# Altium schematic sheet Sheet1.SchDoc
size A4; SheetNumber: 1; SheetTotal: 1
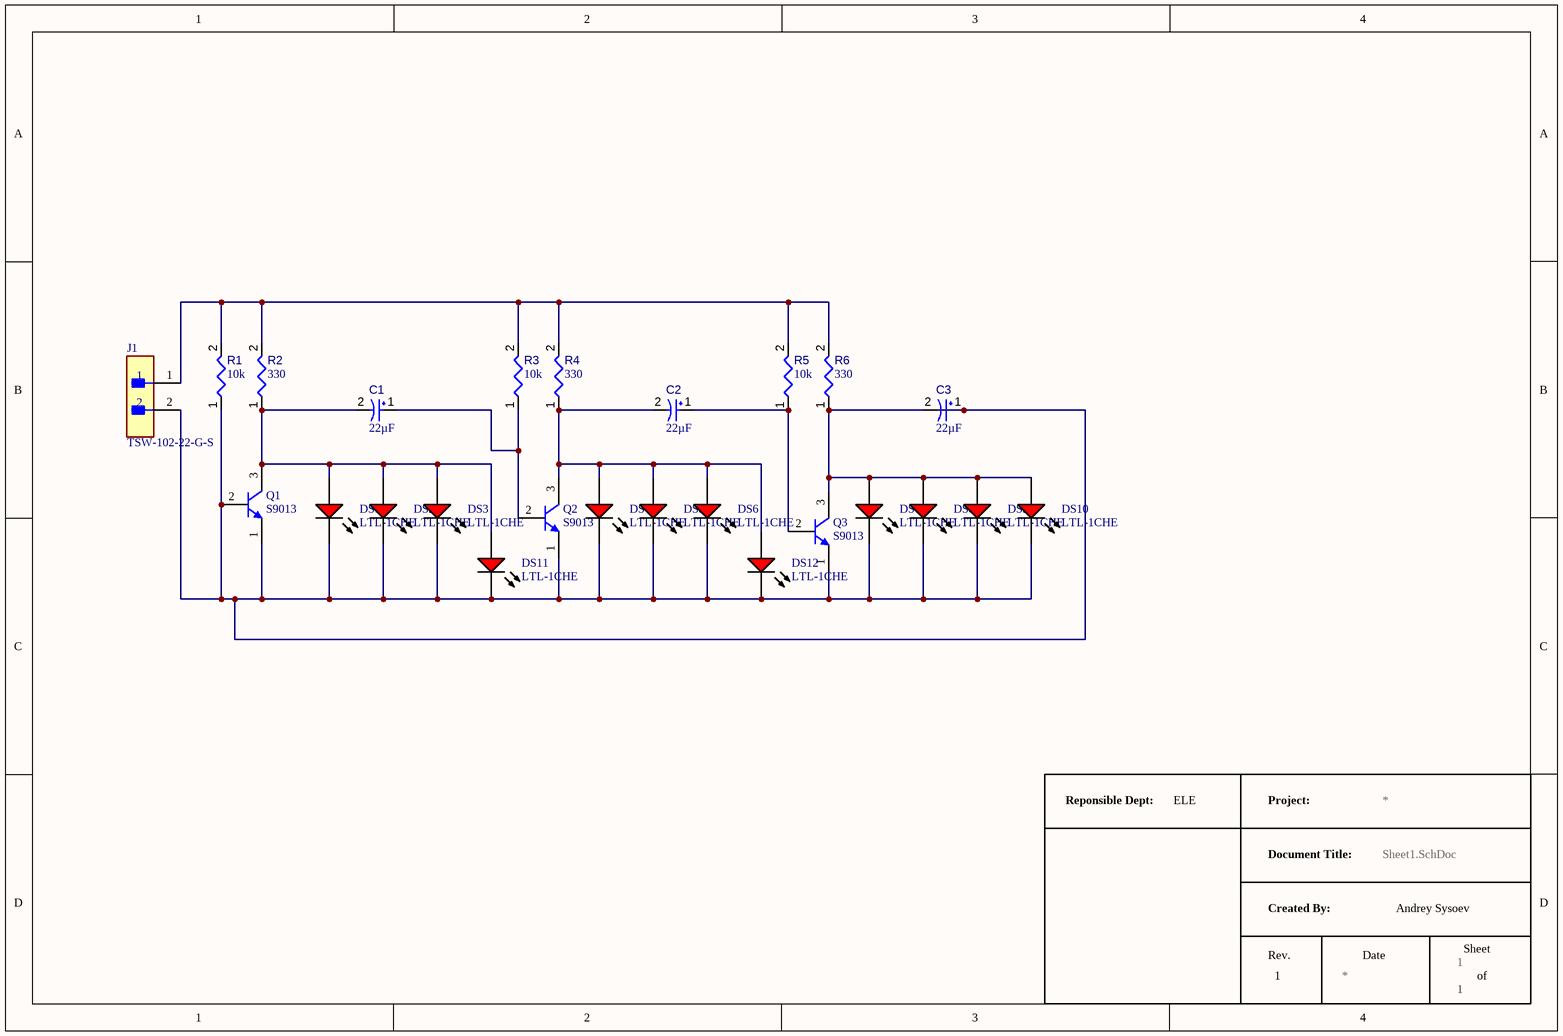
[diagram p0: Sheet1.SchDoc]

## Parts
*  HSHL title block  (value not drawn)  (graphical)
C1  value 22µF  [CAPPR55-250-1120X630X1220]  (hidden comment: ECA-2AM220)
C2  value 22µF  [CAPPR55-250-1120X630X1220]  (hidden comment: ECA-2AM220)
C3  value 22µF  [CAPPR55-250-1120X630X1220]  (hidden comment: ECA-2AM220)
DS1  LTL-1CHE  [INDPR60-254-520X380X650]
DS2  LTL-1CHE  [INDPR60-254-520X380X650]
DS3  LTL-1CHE  [INDPR60-254-520X380X650]
DS4  LTL-1CHE  [INDPR60-254-520X380X650]
DS5  LTL-1CHE  [INDPR60-254-520X380X650]
DS6  LTL-1CHE  [INDPR60-254-520X380X650]
DS7  LTL-1CHE  [INDPR60-254-520X380X650]
DS8  LTL-1CHE  [INDPR60-254-520X380X650]
DS9  LTL-1CHE  [INDPR60-254-520X380X650]
DS10  LTL-1CHE  [INDPR60-254-520X380X650]
DS11  LTL-1CHE  [INDPR60-254-520X380X650]
DS12  LTL-1CHE  [INDPR60-254-520X380X650]
J1  TSW-102-22-G-S  [FP-TSW-102-22-G-S-MFG]
Q1  S9013  [JSCJ-TO-92-3_V]
Q2  S9013  [JSCJ-TO-92-3_V]
Q3  S9013  [JSCJ-TO-92-3_V]
R1  value 10k  [RESA60-630X240]  (hidden comment: MFR-25FBF52-10K)
R2  value 330  [STA_CF18_STP]  (hidden comment: CF18JT330R)
R3  value 10k  [RESA60-630X240]  (hidden comment: MFR-25FBF52-10K)
R4  value 330  [STA_CF18_STP]  (hidden comment: CF18JT330R)
R5  value 10k  [RESA60-630X240]  (hidden comment: MFR-25FBF52-10K)
R6  value 330  [STA_CF18_STP]  (hidden comment: CF18JT330R)

## Nets
NetC1_1: C1.1 Q2.2(B) R3.1
NetC1_2: C1.2 DS1.1(A) DS2.1(A) DS3.1(A) DS11.1(A) Q1.3(C) R2.1
NetC2_1: C2.1 Q3.2(B) R5.1
NetC2_2: C2.2 DS4.1(A) DS5.1(A) DS6.1(A) DS12.1(A) Q2.3(C) R4.1
NetC3_1: C3.1 DS1.2(K) DS2.2(K) DS3.2(K) DS4.2(K) DS5.2(K) DS6.2(K) DS7.2(K) DS8.2(K) DS9.2(K) DS10.2(K) DS11.2(K) DS12.2(K) J1.2 Q1.1(E) Q1.2(B) Q2.1(E) Q3.1(E) R1.1
NetC3_2: C3.2 DS7.1(A) DS8.1(A) DS9.1(A) DS10.1(A) Q3.3(C) R6.1
NetJ1_1: J1.1 R1.2 R2.2 R3.2 R4.2 R5.2 R6.2

## Notes on the sheet
- (in symbol HSHL title block) Reponsible Dept:; ELE; Project:; Document Title:; Created By:; Andrey Sysoev; Sheet; Rev.; Date; 1; of

## Library data of the parts
C1-C3 = CMP-001-00035-7: Aluminum Electrolytic Capacitor, 22 uF, +/- 20%, 100 V, -40 to 85 degC, 2-Pin THD, RoHS, Bulk; Manufacturer: Panasonic; Voltage Rating: 100V; Ripple Current: 115mA; Manufacturer URL: http://www.panasonic.com/; Packaging: Bulk; Package Description: 2-Pin Radial Lead, Dia 6.3 mm, Height 12.2 mm; Datasheet URL: https://industrial.panasonic.com/cdbs/www-data/pdf/RDF0000/ABA0000C1047.pdf; RoHS Compliant: True; Package Quantity: 200; Case/Package: Radial; Package Reference: CAPPR55-250-1120X630X1220; Datasheet Version: Mar-16; Pins: 2; Tolerance: 20%; Diameter: 6.3mm; Max Operating Temperature: 85°C; Ripple Current (AC): 115mA; Capacitor Type: Electrolytic; Mounting Technology: TH; Min Operating Temperature: -40°C; Lead Pitch: 2.5mm
DS1-DS12 = CMP-007-00018-2: LED Uni-Color Red, 100 mW, 30 mA, -55 to 100 degC, 2-Pin THD, RoHS, Bulk; Manufacturer: Lite-On; Forward Current: 20mA; Nominal Vf: 2V; Viewing Angle: 60degrees; Luminous Intensity: 12.6mcd; Lens Style: Dome; Pins: 2; RoHS Compliant: True; Package Reference: LTL-1CHE; Package Quantity: 1000; Mounting Technology: TH; Min Operating Temperature: -55°C; Colour: Red; Case/Package: Radial; Manufacturer URL: http://www.us.liteon.com/; Datasheet URL: https://datasheet.ciiva.com/15117/getdatasheetpartid-187746-15117985.pdf; Forward Voltage: 2V; Max Operating Temperature: 100°C; Illumination Colour: Red; Package Description: 2-Pin Through Hole Device, Dia 3.8 mm, Pitch 2.54 mm; Packaging: Bulk; Datasheet Version: Dec-03
J1 = CMP-002-00072-1: TSW - Samtec 2.54mm Pin Header 16mm Overall Pin Length 7.62mm Tail (22) - Fast Stock(mcv); Voltage Rating: 550V; Max Current Rating: 7.6A; Gender: Male; Pins: 2; Min Operating Temperature: -55°C; Max Operating Temperature: 125°C
Q1-Q3 = CMP-013-00000-3: Transistor, NPN, 0.1 uA, 150 MHz, 3-Pin TO-92; Manufacturer: Jiangsu Changjiang Electronics Technology; Case/Package: TO-92-3; Datasheet URL: http://www.cj-elec.com/txUpfile/20121910315050632.pdf; Datasheet Version: Rev. B, 11/2011; Package Description: 3-Pin Through Hole Device, Height 4.7 mm, Pitch 2.3 mm; Mounting Technology: TH; RoHS Compliant: False; Package Reference: TO-92-3
R1 R3 R5 = CMP-009-00047-4: Axial Resistor, 10 KOhm, +/- 1%, 0.25 W, -55 to 155 degC, 2-Pin THD, RoHS, Bulk; Manufacturer: Yageo; Power: 250mW; Voltage Rating: 250V; Manufacturer URL: http://www.yageo.com/; Datasheet URL: http://www.yageo.com/documents/recent/Yageo%20LR_MFR_2013.pdf; Package Reference: MFR-25; Min Operating Temperature: -55°C; Mounting Technology: TH; Package Quantity: 200; Case/Package: Axial; Tolerance: 1%; RoHS Compliant: True; Datasheet Version: Apr-13; Packaging: Bulk; Max Operating Temperature: 155°C; Package Description: 2-Pin Axial Lead, Dia 2.4 mm, Body Length 6.3 mm
R2 R4 R6 = CMP-009-00177-2: Fixed Resistor, Carbon Film, 0.125W, 330ohm, 250V, 5% +/-Tol, -400, 0ppm/Cel, Through Hole Mount; Case/Package: Conformal; Mounting Technology: Axial, Through Hole; Tolerance: 5%; Max Operating Temperature: 155°C; Min Operating Temperature: -55°C